# EasyEDA Pro project CSR8675_Module_Bluetooth_Speaker.eprj

# Schematic Schematic1
Create Date: 2024-04-20; Page Name: P1; Project Name: CSR8675_Module_Bluetooth_Speaker; Schematic Name: Schematic1; Update Date: 2024-04-27; Company: 嘉立创EDA; Page Size: A4; Version: V1.0
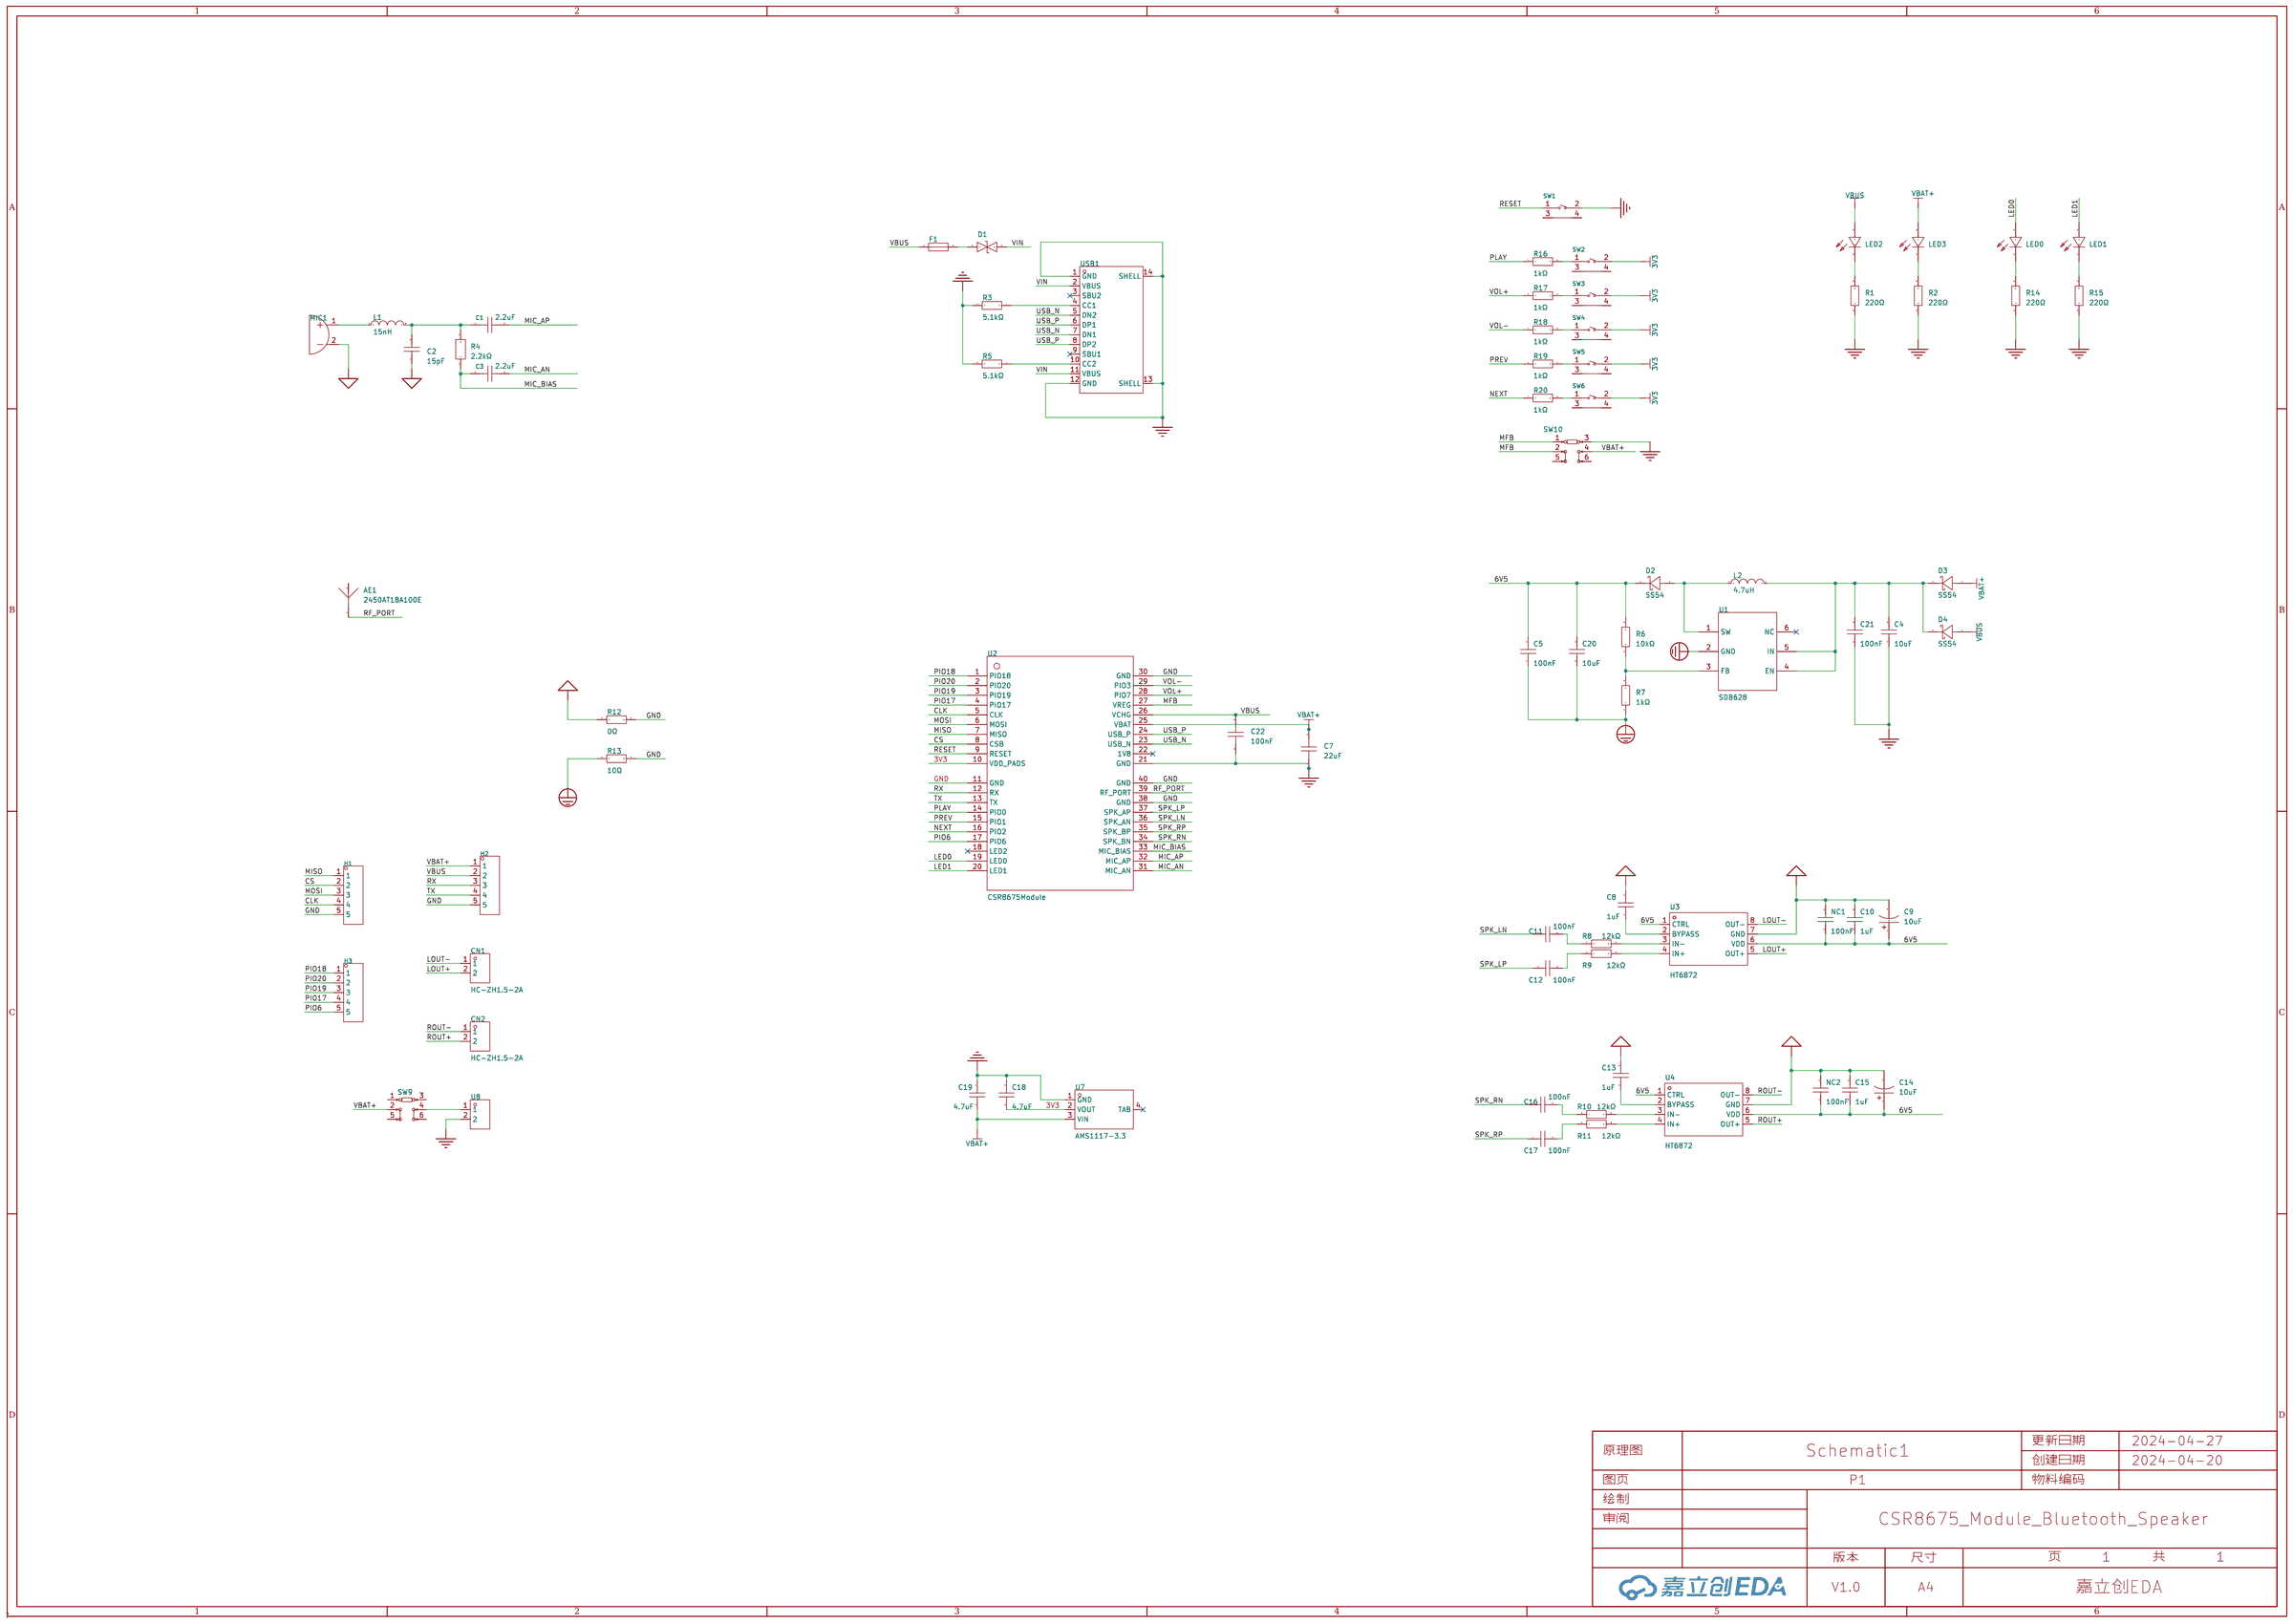
[diagram p0: schematic sheet]

## Parts
AE1  2450AT18A100E  [ANT-SMD_L3.2-W1.6]
C1  2.2uF  [C0603]
C2  15pF  [C0603]
C3  2.2uF  [C0603]
C4  10uF  [C0603]
C5  100nF  [C0603]
C7  22uF  [c0805]
C8  1uF  [C0603]
C9  10uF  [CAP-TH_BD5.0-P2.00-D0.8-FD]
C10  1uF  [C0603]
C11  100nF  [C0603]
C12  100nF  [C0603]
C13  1uF  [C0603]
C14  10uF  [CAP-TH_BD5.0-P2.00-D0.8-FD]
C15  1uF  [C0603]
C16  100nF  [C0603]
C17  100nF  [C0603]
C18  4.7uF  [c0805]
C19  4.7uF  [c0805]
C20  10uF  [C0603]
C21  100nF  [C0603]
C22  100nF  [C0603]
CN1  HC-ZH1.5-2A  [CONN-TH_2P-P1.50_HCTL_HC-ZH1.5-2A]
CN2  HC-ZH1.5-2A  [CONN-TH_2P-P1.50_HCTL_HC-ZH1.5-2A]
D1  0603ESDA-05N  [D0603-BI]
D2  SS54  [SMA_L4.3-W2.6-LS5.0-FD]
D3  SS54  [SMA_L4.3-W2.6-LS5.0-FD]
D4  SS54  [SMA_L4.3-W2.6-LS5.0-FD]
F1  BSMD1210L-500  [F1210]
H1  -  [HDR-TH_5P-P2.54-V-M]
H2  -  [HDR-TH_5P-P2.54-V-M]
H3  -  [HDR-TH_5P-P2.54-V-M]
L1  15nH  [L0805]
L2  4.7uH  [IND-SMD_L4.4-W4.2]
LED0  NCD0603R1  [LED0603-RD_RED]
LED1  NCD0603R1  [LED0603-RD_RED]
LED2  NCD0603R1  [LED0603-RD_RED]
LED3  NCD0603R1  [LED0603-RD_RED]
MIC1  GMI6027P-34DB  [MIC-TH_BD6.0-P1.90-D0.4-L]
NC1  100nF  [C0603]
NC2  100nF  [C0603]
R1  220Ω  [R0603]
R2  220Ω  [R0603]
R3  5.1kΩ  [R0603]
R4  2.2kΩ  [R0603]
R5  5.1kΩ  [R0603]
R6  10kΩ  [R0603]
R7  1kΩ  [R0603]
R8  12kΩ  [R0603]
R9  12kΩ  [R0603]
R10  12kΩ  [R0603]
R11  12kΩ  [R0603]
R12  0Ω  [R0603]
R13  10Ω  [R0603]
R14  220Ω  [R0603]
R15  220Ω  [R0603]
R16  1kΩ  [R0603]
R17  1kΩ  [R0603]
R18  1kΩ  [R0603]
R19  1kΩ  [R0603]
R20  1kΩ  [R0603]
SW1  TC-6615-5-260G  [SW-TH_4P-L7.5-W5.0-P4.50]
SW2  TC-6615-5-260G  [SW-TH_4P-L7.5-W5.0-P4.50]
SW3  TC-6615-5-260G  [SW-TH_4P-L7.5-W5.0-P4.50]
SW4  TC-6615-5-260G  [SW-TH_4P-L7.5-W5.0-P4.50]
SW5  TC-6615-5-260G  [SW-TH_4P-L7.5-W5.0-P4.50]
SW6  TC-6615-5-260G  [SW-TH_4P-L7.5-W5.0-P4.50]
SW9  XKB5858-Z-E  [SW-TH_XKB5858-Z-E]
SW10  XKB5858-Z-E  [SW-TH_XKB5858-Z-E]
U1  SDB628  [SOT-23-6_L2.9-W1.6-P0.95-LS2.8-BR]
U2  CSR8675Module  [CSR8675Module]
U3  HT6872  [SOP-8_L4.9-W3.9-P1.27-LS6.0-BL]
U4  HT6872  [SOP-8_L4.9-W3.9-P1.27-LS6.0-BL]
U7  AMS1117-3.3  [SOT-223-3_L6.5-W3.5-P3.05-LS7.0]
U8  WAFER-XH254Z-2A  [CONN-TH_2P-P2.50_XH-2A_3045048]
USB1  TYPE-C 16PIN 2MD(073)  [USB-C-SMD_TYPE-C-6PIN-2MD-073]

## Library data of the parts
AE1 = 2450AT18A100E: 天线类型:2.4G天线;中心频点:2.4GHz;带宽:-;峰值增益:0.5dBi;极化方式:-;功率容量:2W;驻波比:-;; LCSC Part Name: 2.4G天线; Supplier Part: C89334; Manufacturer: JOHANSON(约翰逊); Supplier Footprint: 1206; JLCPCB Part Class: 扩展库; Datasheet: https://atta.szlcsc.com/upload/public/pdf/source/20180301/C89334_15198946260391384223.pdf; Supplier: LCSC; Antenna Type: 2.4G天线; Central Frequency: 2.4GHz; Peak Gain: 0.5dBi; Impedance: 50Ω; Power capacity: 2W; Operating Temperature: -40℃~+125℃
C1 C3 = CL10A225KB8NNNC: 容值:2.2uF;精度:±10%;额定电压:50V;材质(温度系数):X5R;; LCSC Part Name: 2.2uF ±10% 50V; Supplier Part: C913904; Manufacturer: SAMSUNG(三星); Supplier Footprint: 0603; JLCPCB Part Class: 扩展库; Datasheet: https://atta.szlcsc.com/upload/public/pdf/source/20160218/1457707763339.pdf; Supplier: LCSC; Tolerance: ±10%; Voltage Rated: 50V; Temperature Coefficient: X5R
C2 = CC0603JRNPO9BN150: 容值:15pF;精度:±5%;额定电压:50V;材质(温度系数):NP0;; LCSC Part Name: 15pF ±5% 50V; Supplier Part: C107037; Manufacturer: YAGEO(国巨); Supplier Footprint: 0603; JLCPCB Part Class: 扩展库; Datasheet: https://atta.szlcsc.com/upload/public/pdf/source/20170914/C128857_1505359892143968080.pdf; Supplier: LCSC; Tolerance: ±5%; Voltage Rated: 50V; Temperature Coefficient: NP0
C4 C5 C8 C10 C13 C15 C20 C21 = CL10A105KB8NNNC: 容值:1uF;精度:±10%;额定电压:50V;材质(温度系数):X5R;; LCSC Part Name: 1uF ±10% 50V; Supplier Part: C15849; Manufacturer: SAMSUNG(三星); Supplier Footprint: 0603; JLCPCB Part Class: 基础库; Datasheet: https://atta.szlcsc.com/upload/public/pdf/source/20160218/1457707763339.pdf; Supplier: LCSC; Tolerance: ±10%; Voltage Rated: 50V; Temperature Coefficient: X5R
C7 = CL21A226MAQNNNE: 容值:22uF;精度:±20%;额定电压:25V;材质(温度系数):X5R;; LCSC Part Name: 22uF ±20% 25V; Supplier Part: C45783; Manufacturer: SAMSUNG(三星); Supplier Footprint: 0805; JLCPCB Part Class: 基础库; Datasheet: https://atta.szlcsc.com/upload/public/pdf/source/20160218/1457707763339.pdf; Supplier: LCSC; Tolerance: ±20%; Voltage Rated: 25V; Temperature Coefficient: X5R
C9 C14 = 01EC1809SHC10UF50V: 容值:10uF;精度:±20%;额定电压:50V;纹波电流:50mA@120Hz;等效串联电阻:-;; LCSC Part Name: 10uF ±20% 50V; Supplier Part: C503219; Manufacturer: KNSCHA(科尼盛); Supplier Footprint: 插件,D5xL11mm; JLCPCB Part Class: 扩展库; Datasheet: https://atta.szlcsc.com/upload/public/pdf/source/20200324/C503219_39D1683F20D4DB1C41D8BE9142629697.pdf; Supplier: LCSC; Tolerance: ±20%; Rated Voltage: 50V; Ripple Current: 50mA@120Hz; Lead Spacing: 2mm; φD: 5mm; L: 11mm; Lifetime @ Temp: 5000hrs@105℃
C11 C12 C16 C17 = 0603B104K500NT: 容值:100nF;精度:±10%;额定电压:50V;材质(温度系数):X7R;; LCSC Part Name: 100nF ±10% 50V; Supplier Part: C30926; Manufacturer: FH(风华); Supplier Footprint: 0603; JLCPCB Part Class: 扩展库; Datasheet: https://atta.szlcsc.com/upload/public/pdf/source/20200305/C486355_26A10D38EF8C2A5C37091D0039909270.pdf; Supplier: LCSC; Tolerance: ±10%; Voltage Rated: 50V; Temperature Coefficient: X7R
C18 C19 = CL21A475KAQNNNE: 容值:4.7uF;精度:±10%;额定电压:25V;材质(温度系数):X5R;; LCSC Part Name: 4.7uF ±10% 25V; Supplier Part: C1779; Manufacturer: SAMSUNG(三星); Supplier Footprint: 0805; JLCPCB Part Class: 基础库; Datasheet: https://atta.szlcsc.com/upload/public/pdf/source/20160218/1457707763339.pdf; Supplier: LCSC; Tolerance: ±10%; Voltage Rated: 25V; Temperature Coefficient: X5R
C22 = CC0603KRX7R9BB104: 容值:100nF;精度:±10%;额定电压:50V;材质(温度系数):X7R;; LCSC Part Name: 100nF ±10% 50V; Supplier Part: C14663; Manufacturer: YAGEO(国巨); Supplier Footprint: 0603; JLCPCB Part Class: 基础库; Datasheet: https://atta.szlcsc.com/upload/public/pdf/source/20180910/C282072_33301C7F631E79921B82A8DAC6BCC5B3.pdf; Supplier: LCSC; Tolerance: ±10%; Voltage Rated: 50V; Temperature Coefficient: X7R
CN1 CN2 = HC-ZH1.5-2A: 插针结构:1x2P;间距:1.5mm;安装方式:直插;参考系列:ZH;总PIN数:2P;排数:1;每排PIN数:2;行距:-;额定电流:1A;触头材质:黄铜;触头镀层:锡;工作温度范围:-25℃~+85℃;; LCSC Part Name: 1x2P 间距:1.5mm 直插 系列:ZH; Supplier Part: C2845550; Manufacturer: HCTL(华灿天禄); Supplier Footprint: 插件,P=1.5mm; JLCPCB Part Class: 扩展库; Datasheet: https://atta.szlcsc.com/upload/public/pdf/source/20230711/891FEA77A098E3B44CC72703EA57A8B8.pdf; Supplier: LCSC; Pins Structure: 1x2P; Pitch: 1.5mm; Mounting Style: 直插; Reference Series: ZH; Number of Pins: 2P; Number of Rows: 1; Number of PINs Per Row: 2; Current Rating (Max): 1A; Contact Material: 黄铜; Contact Plating: 锡; Operating Temperature Range: -25℃~+85℃
D1 = 0603ESDA-05N: 极性:双向;反向截止电压(Vrwm):5V;最大钳位电压:50V;; LCSC Part Name: 双向ESD; Supplier Part: C316054; Manufacturer: BORN(伯恩半导体); Supplier Footprint: 0603; JLCPCB Part Class: 扩展库; Datasheet: https://atta.szlcsc.com/upload/public/pdf/source/20200528/C316054_1CC523E9CE69E41C8DD5A05C832CCD1A.pdf; Supplier: LCSC; polarity: 双向; Reverse Stand-Off Voltage (Vrwm): 5V; Maximum Clamping Voltage: 50V; Type: ESD
D2-D4 = SS54_C7420369: 二极管配置:独立式;正向压降(Vf):550mV@5.0A;直流反向耐压(Vr):40V;平均整流电流(Io):5A;; LCSC Part Name: 电压:40V 电流:5A; Supplier Part: C7420369; Manufacturer: 宏迦橙; Supplier Footprint: SMA(DO-214AC); JLCPCB Part Class: 扩展库; Datasheet: https://atta.szlcsc.com/upload/public/pdf/source/20230828/254C3882F8647358AD9F60DD73611B5E.pdf; Supplier: LCSC; Diode Configuration: 独立式; Forward Voltage (Vf@If): 550mV@5.0A; Reverse Voltage (Vr): 40V; Average Rectified Current (Io): 5A; Reverse Leakage Current (Ir): 50uA@40V; Peak forward surge current: 120A
F1 = BSMD1210L-500: 最大电压:6V;最大电流:50A;保持电流:5A;跳闸电流:10A;; LCSC Part Name: 6V 5A 1210自恢复; Supplier Part: C976308; Manufacturer: BHFUSE(佰宏); Supplier Footprint: 1210; JLCPCB Part Class: 扩展库; Datasheet: https://atta.szlcsc.com/upload/public/pdf/source/20230512/9080FFF75F270CBB88A3FCF75D568934.pdf; Supplier: LCSC; Operating Voltage (Max): 6V; Current Rating (Max): 50A; Hold Current: 5A; Trip Current: 10A; Power Dissipation: 1.5W; Resistance - Initial (Ri) (Min): 1mΩ; Resistance - Post Trip (R1) (Max): 12mΩ; Maximum Time to Trip: 5s; Operating Temperature: -40℃~+85℃
H1-H3 = HDR-M_2.54_1x5P: Supplier Part: C358687; Supplier Footprint: 插件
L1 = VHF201209H15NJT: 电感值:15nH;精度:±5%;额定电流:300mA;饱和电流(Isat):-;直流电阻(DCR):400mΩ;; LCSC Part Name: 15nH ±5%; Supplier Part: C139275; Manufacturer: FH(风华); Supplier Footprint: 0805; JLCPCB Part Class: 扩展库; Datasheet: https://atta.szlcsc.com/upload/public/pdf/source/20230223/DB206AC541C71FBD79E291598E86C2F5.pdf; Supplier: LCSC; Tolerance: ±5%; Rated Current: 300mA; DC Resistance (DCR): 400mΩ
L2 = FXL0420-4R7-M: 电感值:4.7uH;精度:±20%;额定电流:2.8A;饱和电流(Isat):3A;类型:一体成型电感;; LCSC Part Name: 4.7uH ±20% 3A; Supplier Part: C167208; Manufacturer: cjiang(长江微电); Supplier Footprint: SMD,4.2x4.4mm; JLCPCB Part Class: 扩展库; Datasheet: https://atta.szlcsc.com/upload/public/pdf/source/20230516/FBADA9890E7FBE97C620F1D8B562D733.pdf; Supplier: LCSC; Tolerance: ±20%; Rated Current: 2.8A; Saturation Current (Isat): 3A; DC Resistance (DCR): 105mΩ; Type: 一体成型电感
LED0-LED3 = NCD0603R1_C84263: 灯头类型:-;发光颜色:红色;正向电压(VF):1.6V~2.6V;功率:65mW;正向电流:20mA;主波长:615nm~630nm;二极管配置:独立二极管;透镜颜色:无色透明透镜;色温:-;发光强度:80mcd~220mcd;发光角度:130°;载带方式:-;工作温度:-30℃~+85℃;; Supplier Part: C84263; Manufacturer: 国星光电; Supplier Footprint: 0603; JLCPCB Part Class: 扩展库; Datasheet: https://atta.szlcsc.com/upload/public/pdf/source/20200820/C84263_DABC6A75E58F576973B407FDBA283D60.pdf; Supplier: LCSC; Emitted Color: 红色; Forward Voltage (VF): 1.6V~2.6V; Power Dissipation: 65mW; Forward Current: 20mA; Dominant Wavelength: 615nm~630nm; Diode Configuration: 独立二极管; Lens Color: 无色透明透镜; Luminous Intensity: 80mcd~220mcd; Viewing Angle: 130°; Operating Temperature: -30℃~+85℃
MIC1 = GMI6027P-34DB: Supplier Part: C529954; Manufacturer: INGHAi(赢海); JLCPCB Part Class: 扩展库; Datasheet: https://atta.szlcsc.com/upload/public/pdf/source/20200702/C529952_807F7012EAC801A742D0A79789145B73.pdf; Supplier: LCSC
NC1 NC2 = CC0603KRX7R9BB103: 容值:10nF;精度:±10%;额定电压:50V;材质(温度系数):X7R;; LCSC Part Name: 10nF ±10% 50V; Supplier Part: C100042; Manufacturer: YAGEO(国巨); Supplier Footprint: 0603; JLCPCB Part Class: 扩展库; Datasheet: https://atta.szlcsc.com/upload/public/pdf/source/20181008/C309510_22F155564471FAF6A489F7D68F34234E.pdf; Supplier: LCSC; Tolerance: ±10%; Voltage Rated: 50V; Temperature Coefficient: X7R
R1 R2 R14 R15 = 0603WAJ0221T5E: 电阻类型:厚膜电阻;阻值:220Ω;精度:±5%;功率:100mW;最大工作电压:75V;温度系数:±100ppm/℃;; LCSC Part Name: 220Ω ±5% 100mW 厚膜电阻; Supplier Part: C1226; Manufacturer: UNI-ROYAL(厚声); Supplier Footprint: 0603; JLCPCB Part Class: 扩展库; Datasheet: https://atta.szlcsc.com/upload/public/pdf/source/20200306/C422600_1E6D84923E4A46A82E41ADD87F860B5C.pdf; Supplier: LCSC; Type: 厚膜电阻; Tolerance: ±5%; Power(Watts): 100mW; Overload Voltage (Max): 75V; Temperature Coefficient: ±100ppm/℃; Operating Temperature Range: -55℃~+155℃
R3 R5 = 0603WAF5101T5E: 电阻类型:厚膜电阻;阻值:5.1kΩ;精度:±1%;功率:100mW;最大工作电压:75V;温度系数:±100ppm/℃;; LCSC Part Name: 5.1kΩ ±1% 100mW 厚膜电阻; Supplier Part: C23186; Manufacturer: UNI-ROYAL(厚声); Supplier Footprint: 0603; JLCPCB Part Class: 基础库; Datasheet: https://atta.szlcsc.com/upload/public/pdf/source/20200306/C422600_1E6D84923E4A46A82E41ADD87F860B5C.pdf; Supplier: LCSC; Type: 厚膜电阻; Tolerance: ±1%; Power(Watts): 100mW; Overload Voltage (Max): 75V; Temperature Coefficient: ±100ppm/℃; Operating Temperature Range: -55℃~+155℃
R4 = FRC0603J222 TS: 电阻类型:厚膜电阻;阻值:2.2kΩ;精度:±5%;功率:100mW;最大工作电压:75V;温度系数:±100ppm/℃;; LCSC Part Name: 2.2kΩ ±5% 100mW 厚膜电阻; Supplier Part: C2907117; Manufacturer: FOJAN(富捷); Supplier Footprint: 0603; JLCPCB Part Class: 扩展库; Datasheet: https://atta.szlcsc.com/upload/public/pdf/source/20211221/925EC7D7225764EE0046F22065062C87.pdf; Supplier: LCSC; Type: 厚膜电阻; Tolerance: ±5%; Power(Watts): 100mW; Overload Voltage (Max): 75V; Temperature Coefficient: ±100ppm/℃; Operating Temperature Range: -55℃~+155℃
R6 = 0603WAF1002T5E: 电阻类型:厚膜电阻;阻值:10kΩ;精度:±1%;功率:100mW;最大工作电压:75V;温度系数:±100ppm/℃;; LCSC Part Name: 厚膜电阻 10kΩ ±1% 100mW; Supplier Part: C25804; Manufacturer: UNI-ROYAL(厚声); Supplier Footprint: 0603; JLCPCB Part Class: 基础库; Datasheet: https://atta.szlcsc.com/upload/public/pdf/source/20200306/C422600_1E6D84923E4A46A82E41ADD87F860B5C.pdf; Supplier: LCSC; Type: 厚膜电阻; Tolerance: ±1%; Power(Watts): 100mW; Overload Voltage (Max): 75V; Temperature Coefficient: ±100ppm/℃; Operating Temperature Range: -55℃~+155℃
R7 R16-R20 = RC0603FR-071KL: 电阻类型:厚膜电阻;阻值:1kΩ;精度:±1%;功率:100mW;最大工作电压:75V;温度系数:±100ppm/℃;; LCSC Part Name: 厚膜电阻 1kΩ ±1% 100mW; Supplier Part: C22548; Manufacturer: YAGEO(国巨); Supplier Footprint: 0603; JLCPCB Part Class: 扩展库; Datasheet: https://atta.szlcsc.com/upload/public/pdf/source/20180316/70C0E2BDAE7FCC62C531A5A58D202EE1.pdf; Supplier: LCSC; Type: 厚膜电阻; Tolerance: ±1%; Power(Watts): 100mW; Overload Voltage (Max): 75V; Temperature Coefficient: ±100ppm/℃; Operating Temperature Range: -55℃~+155℃
R8-R11 = 0603WAF1202T5E: 电阻类型:厚膜电阻;阻值:12kΩ;精度:±1%;功率:100mW;最大工作电压:75V;温度系数:±100ppm/℃;; LCSC Part Name: 12kΩ ±1% 100mW 厚膜电阻; Supplier Part: C22790; Manufacturer: UNI-ROYAL(厚声); Supplier Footprint: 0603; JLCPCB Part Class: 基础库; Datasheet: https://atta.szlcsc.com/upload/public/pdf/source/20200306/C422600_1E6D84923E4A46A82E41ADD87F860B5C.pdf; Supplier: LCSC; Type: 厚膜电阻; Tolerance: ±1%; Power(Watts): 100mW; Overload Voltage (Max): 75V; Temperature Coefficient: ±100ppm/℃; Operating Temperature Range: -55℃~+155℃
R12 R13 = 0603WAF0000T5E: 电阻类型:厚膜电阻;阻值:0Ω;精度:±1%;功率:100mW;最大工作电压:75V;; LCSC Part Name: 0Ω ±1% 100mW 厚膜电阻; Supplier Part: C21189; Manufacturer: UNI-ROYAL(厚声); Supplier Footprint: 0603; JLCPCB Part Class: 基础库; Datasheet: https://atta.szlcsc.com/upload/public/pdf/source/20200306/C422600_1E6D84923E4A46A82E41ADD87F860B5C.pdf; Supplier: LCSC; Type: 厚膜电阻; Tolerance: ±1%; Power(Watts): 100mW; Overload Voltage (Max): 75V; Operating Temperature Range: -55℃~+155℃
SW1-SW6 = TC-6615-5-260G: 电路结构:单刀单掷;按钮形状:-;作用力:260gf;安装方式:卧插;开关长度:6mm;开关宽度:6mm;开关高度:5mm;带支架:带支架;触点电流:50mA;额定电压(AC):-;额定电压(DC):12V;额定功率:-;绝缘电阻:-;带灯:-;机械寿命:-;; LCSC Part Name: 轻触6*6*5支架 插件260g; Supplier Part: C2845270; Manufacturer: HCTL(华灿天禄); Supplier Footprint: 插件; JLCPCB Part Class: 扩展库; Datasheet: https://atta.szlcsc.com/upload/public/pdf/source/20230523/3B07ECEFF69432C539FEAF1B55455C52.pdf; Supplier: LCSC; Circuit: 单刀单掷; Operating Force: 260gf; Mounting Style: 卧插; Switch Length: 6mm; Switch Width: 6mm; Switch Height: 5mm; Strike Gundam: 带支架; Contact Current: 50mA; Voltage Rating (DC): 12V
SW9 SW10 = XKB5858-Z-E: 自锁/无锁:自锁;安装方式:卧插;触点电流:100mA;额定电压 (AC):250V;额定电压 (DC):30V;带灯:不带;作用力:250gf;机械寿命:10万次;; Supplier Part: C780038; Manufacturer: XKB Connectivity(中国星坤); Supplier Footprint: 插件; JLCPCB Part Class: 扩展库; Datasheet: https://atta.szlcsc.com/upload/public/pdf/source/20211011/56D3FA9FC185EAC41365C3B37B684CC1.pdf; Supplier: LCSC; Self Lock / No Lock: 自锁; Actuator Style: 方形按钮; Mounting Style: 卧插; Contact Current: 100mA; Voltage Rating (AC): 250V; Voltage Rating (DC): 30V; Insulation Resistance: 100MΩ; Actuator/Cap Color: 白色; With Lamp: 不带; Pin Style: PC引脚; Operating Force: 250gf; Operating Temperature: -15℃~+55℃; Mechanical Life: 10万次
U1 = SDB628: 功能类型:升压型;输入电压:2V~24V;输出电压:28V;输出电流(最大值):2A;; Supplier Part: C77805; Manufacturer: SHOUDING(首鼎半导体); Supplier Footprint: SOT-23-6; JLCPCB Part Class: 扩展库; Datasheet: https://atta.szlcsc.com/upload/public/pdf/source/20160823/1471947522087.pdf; Supplier: LCSC; Function: 升压型; Input Voltage: 2V~24V; Output Voltage: 28V; Output Current (Max): 2A; Switching Frequency: 1.2MHz; Synchronous Rectification: 否; Number of Outputs: 1; Topology: 升压式; Switch tube (built-in/external): 内置
U2 = CSR8675module: 蓝牙库
U3 U4 = HT6872: 功放类型:D类功放;扬声器通道数:单声道;输出功率:3.85Wx1@4Ω;; LCSC Part Name: 3.85W单声道D类音频功率放大器; Supplier Part: C93112; Manufacturer: 嘉兴禾润; Supplier Footprint: SOP-8; JLCPCB Part Class: 扩展库; Datasheet: https://atta.szlcsc.com/upload/public/pdf/source/20170925/C93112_1506321759294990568.pdf; Supplier: LCSC; Type of Power Amplifier: D类功放; Speaker Channels: 单声道; Output Power: 3.85Wx1@4Ω; Supply Voltage: 2.5V~6.5V
U7 = AMS1117-3.3_C5250992: 输出类型：固定 输出极性：正 最大输入电压：18V 输出电压：3.3V 输出电流：1A 电源纹波抑制比(PSRR)：60dB@(120Hz)。当前应用较多领域：三端稳压器，机顶盒; Supplier Part: C5250992; Manufacturer: TWGMC(台湾迪嘉); Supplier Footprint: SOT-223-3L; JLCPCB Part Class: 扩展库; Datasheet: https://atta.szlcsc.com/upload/public/pdf/source/20221109/A58A92B07670E85D28928AE371260E8D.pdf; Supplier: LCSC
U8 = WAFER-XH254Z-2A: 插针结构:1x2P;间距:2.54mm;安装方式:直插;参考系列:XH;总PIN数:2P;排数:1;每排PIN数:2;额定电流:3A;工作温度范围:-25℃~+85℃;; Supplier Part: C7432682; Manufacturer: HANBO(汉博); Supplier Footprint: 插件,P=2.5mm; JLCPCB Part Class: Extended Part; Datasheet: https://atta.szlcsc.com/upload/public/pdf/source/20230718/3B4FABA5D38EFB02DAF74E7C2B33D98F.pdf; Supplier: LCSC; Pins Structure: 1x2P; Pitch: 2.54mm; Mounting Style: 直插; Reference Series: XH; Number of Pins: 2P; Number of Rows: 1; Number of PINs Per Row: 2; Current Rating (Max): 3A; Operating Temperature Range: -25℃~+85℃
USB1 = TYPE-C 16PIN 2MD(073): 连接器类型:Type-C;标准:-;公母:母;端口数量:1;触点数量:16P;安装方式:卧贴;额定电流 - 电源:5A;工作温度范围:-25℃~+85℃;; LCSC Part Name: Type-C 母 卧贴; Supplier Part: C2765186; Manufacturer: SHOU HAN(首韩); Supplier Footprint: SMD; JLCPCB Part Class: 扩展库; Datasheet: https://atta.szlcsc.com/upload/public/pdf/source/20211123/39B17C16241EAC15C5E277BDA434118E.pdf; Supplier: LCSC; Connector Type: Type-C; Gender: 母; Number of Ports: 1; Number of Contacts: 16P; Mounting Style: 卧贴; Current Rating - Power (Max): 5A; Operating Temperature Range: -25℃~+85℃

## Nets
3V3: C18.2 SW2.2 SW3.2 SW4.2 SW5.2 SW6.2 U2.10(VDD_PADS) U7.2(VOUT)
6V5: C5.2 C9.1 C10.1 C14.1 C15.1 C20.2 D2.2(K) NC1.1 NC2.1 R6.2 U3.1(CTRL) U3.6(VDD) U4.1(CTRL) U4.6(VDD)
AGND: C2.1 C8.2 C9.2 C10.2 C13.2 C14.2 C15.2 MIC1.2 NC1.2 NC2.2 R12.1 U3.7(GND) U4.7(GND)
GND: C4.1 C7.1 C18.1 C19.1 C21.1 C22.1 H1.5 H2.5 R1.1 R2.1 R3.2 R5.2 R12.2 R13.2 R14.1 R15.1 SW1.2 SW10.3 U2.11(GND) U2.21(GND) U2.30(GND) U2.38(GND) U2.40(GND) U7.1(GND) U8.2 USB1.1(GND) USB1.12(GND) USB1.13(SHELL) USB1.14(SHELL)
PGND: C5.1 C20.1 R7.1 R13.1 U1.2(GND)
VBAT+: C7.2 C19.2 D3.1(A) H2.1 LED3.2(A) SW9.2 SW10.4 U2.25(VBAT) U7.3(VIN)
VBUS: C22.2 D4.1(A) F1.1 H2.2 LED2.2(A) U2.26(VCHG)
VIN: D1.2 USB1.2(VBUS) USB1.11(VBUS)
CLK: H1.4 U2.5(CLK)
CS: H1.2 U2.8(CSB)
LED0: LED0.2(A) U2.19(LED0)
LED1: LED1.2(A) U2.20(LED1)
LOUT+: CN1.2 U3.5(OUT+)
LOUT-: CN1.1 U3.8(OUT-)
MFB: SW10.1 SW10.2 U2.27(VREG)
MIC_AN: C3.2 U2.31(MIC_AN)
MIC_AP: C1.2 U2.32(MIC_AP)
MIC_BIAS: C3.1 R4.1 U2.33(MIC_BIAS)
MISO: H1.1 U2.7(MISO)
MOSI: H1.3 U2.6(MOSI)
NEXT: R20.1 U2.16(PIO2)
PIO6: H3.5 U2.17(PIO6)
PIO17: H3.4 U2.4(PIO17)
PIO18: H3.1 U2.1(PIO18)
PIO19: H3.3 U2.3(PIO19)
PIO20: H3.2 U2.2(PIO20)
PLAY: R16.1 U2.14(PIO0)
PREV: R19.1 U2.15(PIO1)
RESET: SW1.1 U2.9(RESET)
RF_PORT: AE1.1(ANT) U2.39(RF_PORT)
ROUT+: CN2.2 U4.5(OUT+)
ROUT-: CN2.1 U4.8(OUT-)
RX: H2.3 U2.12(RX)
SPK_LN: C11.1 U2.36(SPK_AN)
SPK_LP: C12.1 U2.37(SPK_AP)
SPK_RN: C16.1 U2.34(SPK_BN)
SPK_RP: C17.1 U2.35(SPK_BP)
TX: H2.4 U2.13(TX)
USB_N: U2.23(USB_N) USB1.5(DN2) USB1.7(DN1)
USB_P: U2.24(USB_P) USB1.6(DP1) USB1.8(DP2)
VOL+: R17.1 U2.28(PIO7)
VOL-: R18.1 U2.29(PIO3)
$1N572: C1.1 C2.2 L1.2 R4.2
$1N573: L1.1 MIC1.1
$1N825: R3.1 USB1.4(CC1)
$1N826: R5.1 USB1.10(CC2)
$1N842: D1.1 F1.2
$1N1214: R16.2 SW2.1
$1N1216: R17.2 SW3.1
$1N1223: R18.2 SW4.1
$1N1225: R19.2 SW5.1
$1N1227: R20.2 SW6.1
$1N2026: D2.1(A) L2.1 U1.1(SW)
$1N2027: R6.1 R7.2 U1.3(FB)
$1N2036: R8.2 U3.3(IN-)
$1N2037: R9.2 U3.4(IN+)
$1N2038: C11.2 R8.1
$1N2039: C12.2 R9.1
$1N2041: C8.1 U3.2(BYPASS)
$1N2427: R10.2 U4.3(IN-)
$1N2428: R11.2 U4.4(IN+)
$1N2429: C16.2 R10.1
$1N2430: C17.2 R11.1
$1N2432: C13.1 U4.2(BYPASS)
$1N7630: LED2.1(K) R1.2
$1N7631: LED3.1(K) R2.2
$1N10372: SW9.4 U8.1
$1N20314: C4.2 C21.2 D3.2(K) D4.2(K) L2.2 U1.4(EN) U1.5(IN)
$1N24423: LED0.1(K) R14.2
$1N24424: LED1.1(K) R15.2

Not connected (* = marked no-connect by the designer): AE1 2; SW1 3 4; SW2 3 4; SW3 3 4; SW4 3 4; SW5 3 4; SW6 3 4; SW9 1 3 5 6; SW10 5 6; U1 6(NC)*; U2 18(LED2)* 22(1V8)*; U7 4(TAB)*; USB1 3(SBU2)* 9(SBU1)*

# Board PCB1
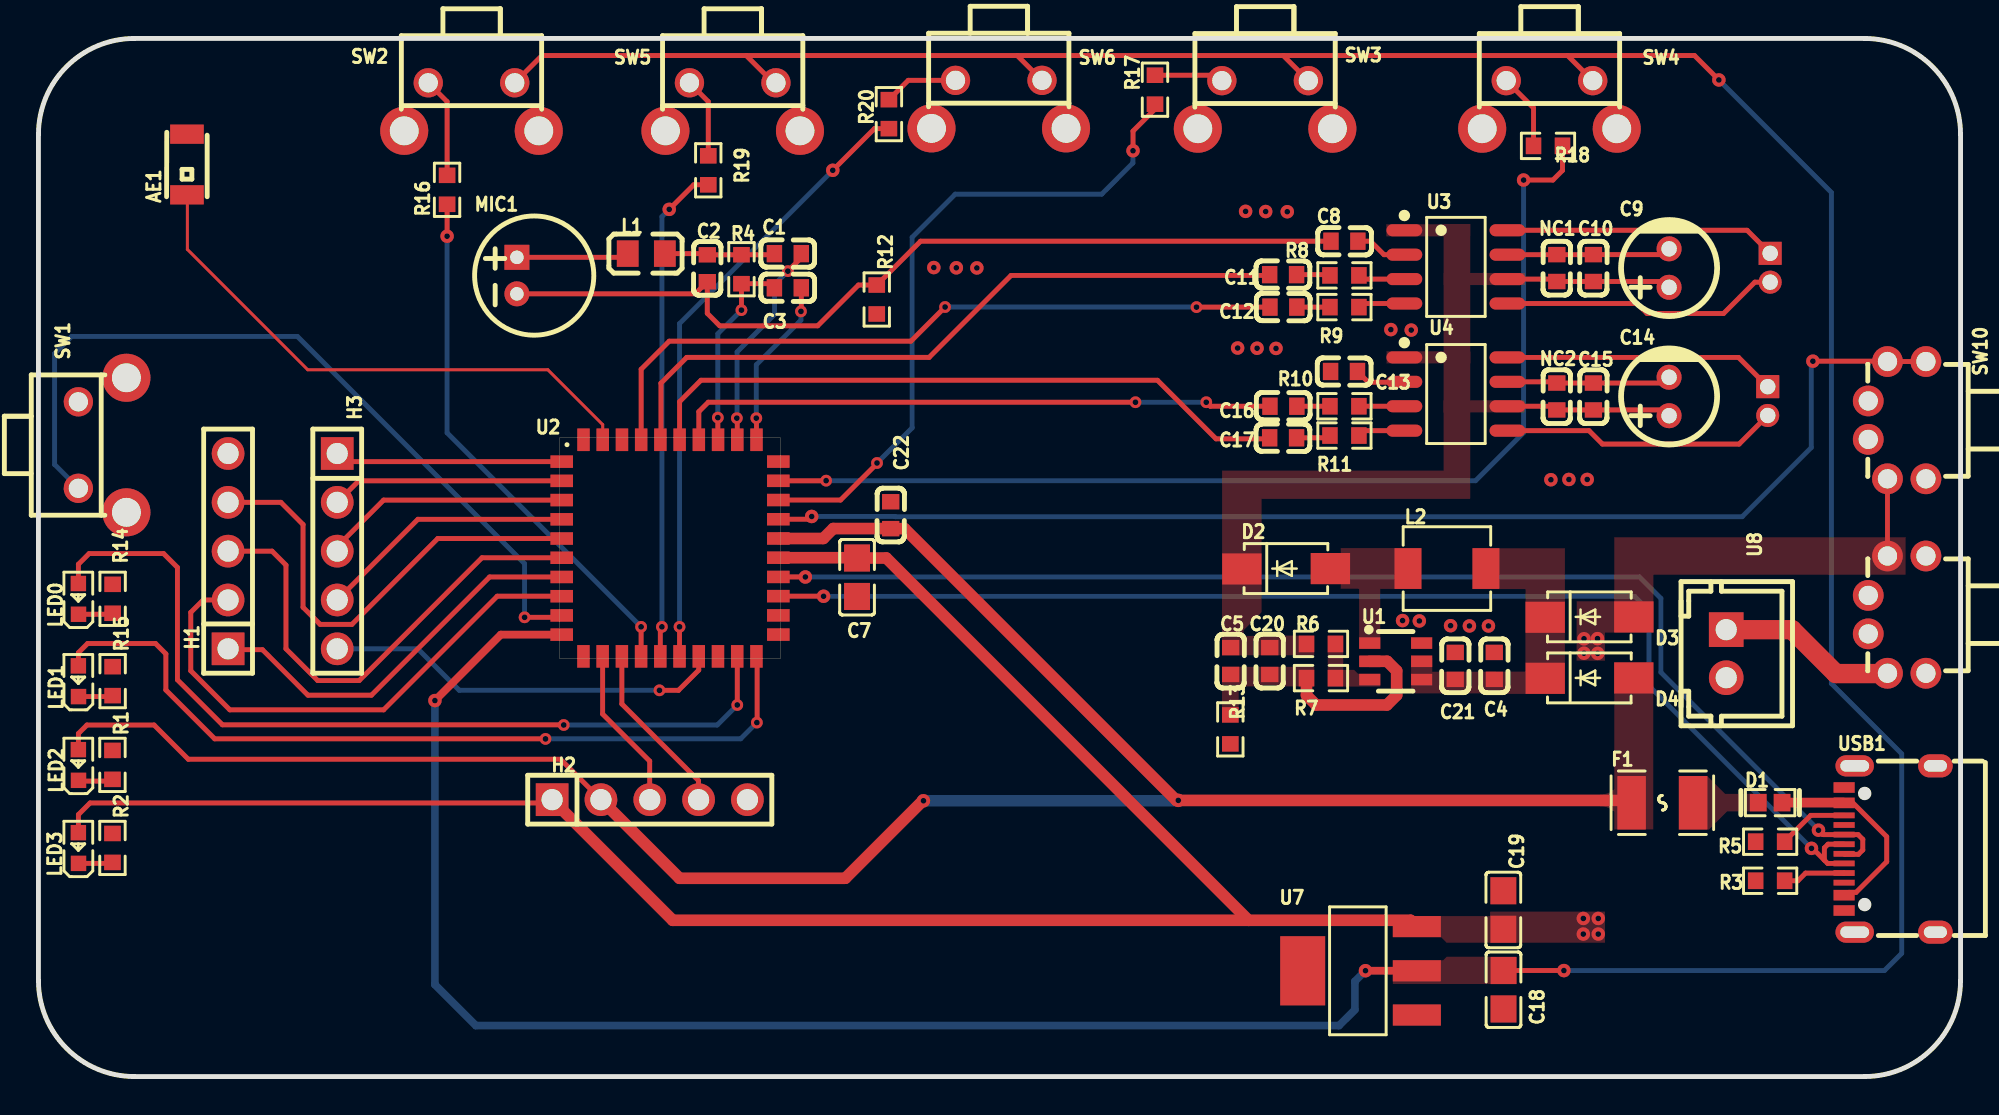
[diagram p1: board, top side]
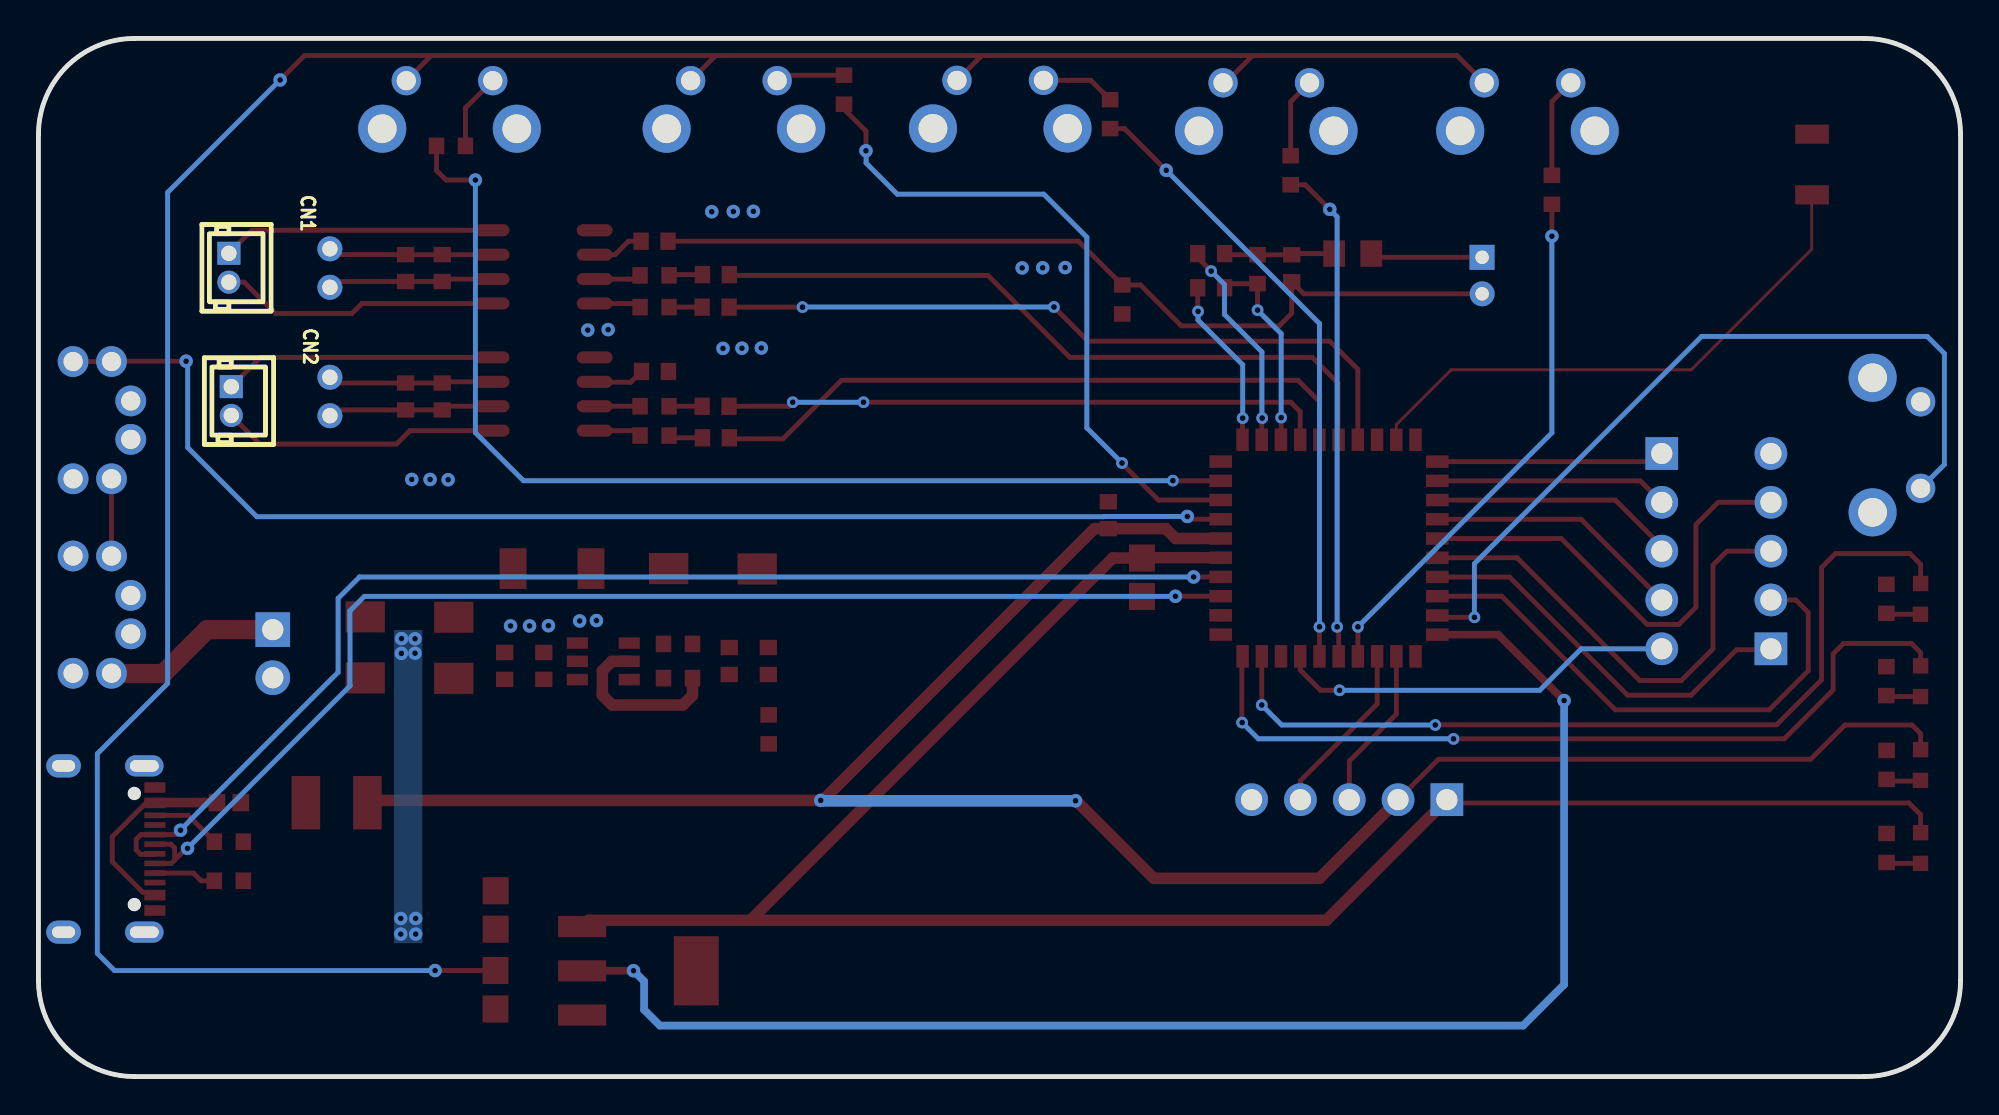
[diagram p2: board, bottom side, seen from below]

Outline 100 x 54 mm; copper layers: Top Layer, Bottom Layer. Coordinates in mm from the lower left corner of the outline.
Outline path: 0,49 0,5 arc(1.46,1.46) 5,0 95,0 arc(98.54,1.46) 100,5 100,49 arc(98.54,52.54) 95,54 5,54 arc(1.46,52.54) 0,49
Stack: Top Layer 0.035mm / Dielectric1 1.51mm FR4 er 4.5 / Bottom Layer 0.035mm

## Design rules (mm)
template: JLCPCB Capability(Two Layers Board)
spacing copperThickness1oz (default): track to track 0.102, other pairs 0.152 to 0.3
spacing copperThickness2oz: track to track 0.203, other pairs 0.152 to 0.3
track width copperThickness1oz (default): min 0.127, default 0.254, max 2.54
track width copperThickness2oz: min 0.203, default 0.254, max 2.54
differential pair differentialPair (default): width min 0.127, default 0.254, max 2.54; gap min 0.152, default 0.152
via viaSize (default): diameter min 0.5, default 0.61, max 10; hole min 0.3, default 0.305, max 6.3

## Placement (name value [footprint] x y rotation side)
AE1  2450AT18A100E  [ANT-SMD_L3.2-W1.6]  7.73 47.44 90 top
C1  2.2uF  [C0603]  38.99 42.81 0 top
C2  15pF  [C0603]  34.8 42.05 90 top
C3  2.2uF  [C0603]  38.99 41.03 0 top
C4  10uF  [C0603]  75.74 21.36 270 top
C5  100nF  [C0603]  62.03 21.61 90 top
C7  22uF  [c0805]  42.59 25.97 90 top
C8  1uF  [C0603]  67.95 43.45 180 top
C9  10uF  [CAP-TH_BD5.0-P2.00-D0.8-FD]  84.84 42.06 90 top
C10  1uF  [C0603]  80.9 42.06 90 top
C11  100nF  [C0603]  64.76 41.71 0 top
C12  100nF  [C0603]  64.77 40.02 0 top
C13  1uF  [C0603]  67.92 36.68 180 top
C14  10uF  [CAP-TH_BD5.0-P2.00-D0.8-FD]  84.84 35.38 90 top
C15  1uF  [C0603]  80.9 35.38 90 top
C16  100nF  [C0603]  64.77 34.87 0 top
C17  100nF  [C0603]  64.76 33.23 0 top
C18  4.7uF  [c0805]  76.22 4.52 90 top
C19  4.7uF  [c0805]  76.21 8.66 270 top
C20  10uF  [C0603]  64.06 21.61 90 top
C21  100nF  [C0603]  73.71 21.36 270 top
C22  100nF  [C0603]  44.34 29.2 270 top
CN1  HC-ZH1.5-2A  [CONN-TH_2P-P1.50_HCTL_HC-ZH1.5-2A]  90.09 42.07 270 bottom
CN2  HC-ZH1.5-2A  [CONN-TH_2P-P1.50_HCTL_HC-ZH1.5-2A]  89.97 35.14 270 bottom
D1  0603ESDA-05N  [D0603-BI]  90.09 14.25 0 top
D2  SS54  [SMA_L4.3-W2.6-LS5.0-FD]  64.91 26.41 180 top
D3  SS54  [SMA_L4.3-W2.6-LS5.0-FD]  80.7 23.9 180 top
D4  SS54  [SMA_L4.3-W2.6-LS5.0-FD]  80.7 20.73 180 top
F1  BSMD1210L-500  [F1210]  84.49 14.24 0 top
H1  -  [HDR-TH_5P-P2.54-V-M]  9.87 27.33 90 top
H2  -  [HDR-TH_5P-P2.54-V-M]  31.8 14.4 0 top
H3  -  [HDR-TH_5P-P2.54-V-M]  15.55 27.33 270 top
L1  15nH  [L0805]  31.62 42.81 0 top
L2  4.7uH  [IND-SMD_L4.4-W4.2]  73.28 26.42 180 top
LED0  NCD0603R1  [LED0603-RD_RED]  2.08 24.85 90 top
LED1  NCD0603R1  [LED0603-RD_RED]  2.08 20.56 90 top
LED2  NCD0603R1  [LED0603-RD_RED]  2.08 16.21 90 top
LED3  NCD0603R1  [LED0603-RD_RED]  2.08 11.89 90 top
MIC1  GMI6027P-34DB  [MIC-TH_BD6.0-P1.90-D0.4-L]  24.89 41.66 270 top
NC1  100nF  [C0603]  78.99 42.06 90 top
NC2  100nF  [C0603]  78.99 35.38 90 top
R1  220Ω  [R0603]  3.85 16.21 270 top
R2  220Ω  [R0603]  3.85 11.89 270 top
R3  5.1kΩ  [R0603]  90.09 10.18 180 top
R4  2.2kΩ  [R0603]  36.58 42 90 top
R5  5.1kΩ  [R0603]  90.09 12.22 180 top
R6  10kΩ  [R0603]  66.73 22.5 180 top
R7  1kΩ  [R0603]  66.73 20.73 0 top
R8  12kΩ  [R0603]  67.95 41.67 0 top
R9  12kΩ  [R0603]  67.95 40.02 0 top
R10  12kΩ  [R0603]  67.95 34.87 0 top
R11  12kΩ  [R0603]  67.95 33.34 0 top
R12  0Ω  [R0603]  43.61 40.42 270 top
R13  10Ω  [R0603]  62.01 18.06 270 top
R14  220Ω  [R0603]  3.86 24.85 270 top
R15  220Ω  [R0603]  3.86 20.57 270 top
R16  1kΩ  [R0603]  21.26 46.13 90 top
R17  1kΩ  [R0603]  58.09 51.33 90 top
R18  1kΩ  [R0603]  78.54 48.41 180 top
R19  1kΩ  [R0603]  34.85 47.14 90 top
R20  1kΩ  [R0603]  44.25 50.06 90 top
SW1  TC-6615-5-260G  [SW-TH_4P-L7.5-W5.0-P4.50]  3.33 32.85 90 top
SW2  TC-6615-5-260G  [SW-TH_4P-L7.5-W5.0-P4.50]  22.53 50.44 0 top
SW3  TC-6615-5-260G  [SW-TH_4P-L7.5-W5.0-P4.50]  63.82 50.55 0 top
SW4  TC-6615-5-260G  [SW-TH_4P-L7.5-W5.0-P4.50]  78.61 50.55 0 top
SW5  TC-6615-5-260G  [SW-TH_4P-L7.5-W5.0-P4.50]  36.12 50.44 0 top
SW6  TC-6615-5-260G  [SW-TH_4P-L7.5-W5.0-P4.50]  49.96 50.57 0 top
SW9  XKB5858-Z-E  [SW-TH_XKB5858-Z-E]  96.7 24.03 270 top
SW10  XKB5858-Z-E  [SW-TH_XKB5858-Z-E]  96.7 34.14 270 top
U1  SDB628  [SOT-23-6_L2.9-W1.6-P0.95-LS2.8-BR]  70.61 21.6 180 top
U2  -  [CSR8675Module]  27.1 21.74 0 top
U3  HT6872  [SOP-8_L4.9-W3.9-P1.27-LS6.0-BL]  73.75 42.12 270 top
U4  HT6872  [SOP-8_L4.9-W3.9-P1.27-LS6.0-BL]  73.75 35.5 270 top
U7  AMS1117-3.3  [SOT-223-3_L6.5-W3.5-P3.05-LS7.0]  68.74 5.5 0 top
U8  WAFER-XH254Z-2A  [CONN-TH_2P-P2.50_XH-2A_3045048]  87.81 22 270 top
USB1  TYPE-C 16PIN 2MD(073)  [USB-C-SMD_TYPE-C-6PIN-2MD-073]  96.32 11.84 90 top

## Footprints (pads in the part's own frame, mm; a bottom-side part is the same pattern mirrored in y, then rotated)
ANT-SMD_L3.2-W1.6
  rect 1x1.75 smd: 1(-1.578,0) 2(1.578,0)
C0603
  rect 0.8x0.9 smd: 1(-0.7,0) 2(0.7,0)
c0805
  rect 1.41x1.35 smd: 1(-1,0) 2(1,0)
CAP-TH_BD5.0-P2.00-D0.8-FD
  round 1.3 hole 0.8: 1(-1,0) 2(1,0)
CONN-TH_2P-P1.50_HCTL_HC-ZH1.5-2A
  rect 1.2x1.2 hole 0.8: 1(-0.75,0)
  round 1.2 hole 0.8: 2(0.75,0)
CONN-TH_2P-P2.50_XH-2A_3045048
  rect 1.8x1.8 hole 1.1: 1(-1.25,0)
  round 1.8 hole 1.1: 2(1.25,0)
CSR8675Module
  custom 1.175x0.65 smd: 1(0.121,10.245) 2(0.121,9.245) 3(0.121,8.245) 4(0.121,7.245) 5(0.121,6.245) 6(0.121,5.245) 7(0.121,4.245) 8(0.121,3.245) 9(0.121,2.245) 10(0.121,1.245) 21(11.391,1.248) 22(11.391,2.248) 23(11.391,3.248) 24(11.391,4.247) 25(11.391,5.247) 26(11.391,6.247) 27(11.391,7.247) 28(11.391,8.248) 29(11.391,9.248) 30(11.391,10.248)
  custom 0.65x1.175 smd: 11(1.252,0.116) 12(2.252,0.116) 13(3.252,0.116) 14(4.252,0.116) 15(5.252,0.116) 16(6.252,0.116) 17(7.252,0.116) 18(8.252,0.116) 19(9.252,0.116) 20(10.252,0.116) 31(10.255,11.382) 32(9.255,11.382) 33(8.255,11.382) 34(7.255,11.382) 35(6.255,11.382) 36(5.255,11.382) 37(4.255,11.382) 38(3.256,11.382) 39(2.256,11.382) 40(1.256,11.382)
D0603-BI
  rect 0.873x0.907 smd: 1(-0.622,0) 2(0.622,0)
F1210
  rect 1.485x2.781 smd: 1(-1.6,0) 2(1.6,0)
HDR-TH_5P-P2.54-V-M
  rect 1.7x1.7 hole 1.1: 1(-5.08,0)
  round 1.7 hole 1.1: 2(-2.54,0) 3(0,0) 4(2.54,0) 5(5.08,0)
IND-SMD_L4.4-W4.2
  rect 1.4x2.12 smd: 1(2.028,0) 2(-2.028,0)
L0805
  rect 1.133x1.377 smd: 1(-0.966,0) 2(0.966,0)
LED0603-RD_RED
  rect 0.8x0.8 smd: 1(-0.799,-0.004) 2(0.799,0.004)
MIC-TH_BD6.0-P1.90-D0.4-L
  rect 1.3x1.3 hole 0.7: 1(-0.95,0)
  round 1.3 hole 0.7: 2(0.95,0)
R0603
  rect 0.806x0.864 smd: 1(-0.753,0) 2(0.753,0)
SMA_L4.3-W2.6-LS5.0-FD
  rect 2.046x1.62 smd: 1(-2.304,-0.009) 2(2.304,0.009)
SOP-8_L4.9-W3.9-P1.27-LS6.0-BL
  oval 0.63x1.865 smd: 1(-1.905,-2.683) 2(-0.635,-2.683) 3(0.635,-2.683) 4(1.905,-2.683) 5(1.905,2.683) 6(0.635,2.683) 7(-0.635,2.683) 8(-1.905,2.683)
SOT-23-6_L2.9-W1.6-P0.95-LS2.8-BR
  rect 1.1x0.6 smd: 1(1.35,-0.95) 2(1.35,0) 3(1.35,0.95) 4(-1.35,0.95) 5(-1.35,0) 6(-1.35,-0.95)
SOT-223-3_L6.5-W3.5-P3.05-LS7.0
  rect 2.5x1.1 smd: 1(2.97,-2.3) 2(2.97,0) 3(2.97,2.3)
  rect 2.34x3.6 smd: 4(-2.97,0)
SW-TH_4P-L7.5-W5.0-P4.50
  round 1.524 hole 1: 1(-2.25,1.25) 2(2.25,1.25)
  round 2.5 hole 1.5: 3(-3.5,-1.25) 4(3.5,-1.25)
SW-TH_XKB5858-Z-E
  round 1.6 hole 1: 1(-3.05,1.5) 2(-3.05,-0.5) 3(3.05,1.5) 4(3.05,-0.5) 5(-1,-1.5) 6(1,-1.5)
USB-C-SMD_TYPE-C-6PIN-2MD-073
  rect 0.55x1.1 smd: 1(-3.2,2.375) 2(-2.4,2.375) 11(2.4,2.375) 12(3.2,2.375)
  rect 0.3x1.1 smd: 3(-1.75,2.375) 4(-1.25,2.375) 5(-0.75,2.375) 6(-0.25,2.375) 7(0.25,2.375) 8(0.75,2.375) 9(1.25,2.375) 10(1.75,2.375)
  oval 1.1x2 hole 0.6x1.5: 13(-4.325,1.825) 14(4.325,1.825)
  oval 1.2x1.8 hole 0.6x1.2: 13(-4.325,-2.375) 14(4.325,-2.375)

## Nets
As in the schematic.

Pads without a net: AE1 2; SW1 3 4; SW2 3 4; SW3 3 4; SW4 3 4; SW5 3 4; SW6 3 4; SW9 1 3 5 6; SW10 5 6; U1 6; U2 18 22; U7 4; USB1 3 9

## Via types
v1: diameter 0.61, hole 0.305, Top Layer to Bottom Layer, 21 vias
v2: diameter 0.7, hole 0.3, Top Layer to Bottom Layer, 44 vias

## Routing (per net, layer and track width the routed paths; a pad name or vN(x,y) marks a point on that pad's centre or on a via; arc(x,y) is an arc through that point)
3V3: length 218.6
  Top Layer w0.254: 64.76,53.11 SW3.2 ; 64.76,53.11 50.92,53.11 ; 64.76,53.11 79.56,53.11 ; SW2.2 26.2,53.11 36.83,53.11 ; 36.83,53.11 38.24,51.69 ; 36.83,53.11 50.92,53.11 ; 50.92,53.11 SW6.2 ; v2(87.43,51.84) 86.16,53.11 79.56,53.11 ; v2(79.36,5.51) 79.36,5.52 C18.2 ; 79.56,53.11 SW4.2
  Top Layer w0.4: v2(20.63,19.56) 24.06,22.99 U2.10 ; U7.2 71.71,5.5 v2(69.04,5.5)
  Bottom Layer w0.254: v2(79.36,5.51) 96.04,5.51 96.94,6.41 96.94,16.79 93.28,20.45 93.28,45.99 v2(87.43,51.84)
  Bottom Layer w0.4: v2(69.04,5.5) 68.49,4.96 68.49,3.48 67.67,2.65 22.76,2.65 20.63,4.78 v2(20.63,19.56)
6V5: length 17.2
  Top Layer w0.254: U4.6 78.8,34.87 NC2.1 C15.1 84.54,34.68 C14.1 ; C9.1 84.54,41.36 C10.1 NC1.1 78.87,41.48 U3.6
AGND: length 63.5
  Top Layer w0.254: C14.2 84.54,36.08 C15.2 NC2.2 78.93,36.14 U4.7 ; 78.99,42.75 NC1.2 ; 78.99,42.75 80.89,42.75 C10.2 84.54,42.76 C9.2 ; 78.99,42.75 U3.7 ; MIC1.2 34.17,40.71 C2.1 34.8,39.7 35.45,39.05 40.54,39.05 42.66,41.17 R12.1 45.89,43.45 C8.2
  vias: v2(62.39,37.9) v2(62.8,45.01) v2(63.4,37.89) v2(63.85,45) v2(64.39,37.88) v2(64.97,44.99) v2(70.36,38.86) v2(71.42,38.83) v2(78.69,31.05) v2(79.62,31.06) v2(80.58,31.06)
GND:
  vias: v2(46.58,42.08) v2(47.75,42.07) v2(48.82,42.06) v2(70.97,23.72) v2(71.84,23.7) v2(73.47,23.45) v2(74.45,23.44) v2(75.44,23.44)
PGND: length 8.9
  Top Layer w0.6: R7.1 65.97,19.83 66.47,19.33 70.16,19.33 70.66,19.84 70.66,21.11 70.17,21.6 U1.2
VBAT+: length 109.9
  Top Layer w0.254: 2.08,12.69 2.08,13.62 2.69,14.23 26.55,14.23 H2.1 ; SW10.4 SW9.2
  Top Layer w0.6: H2.1 33,8.13 62.96,8.13 ; 62.96,8.13 44.11,26.97 C7.2 42.57,26.99 U2.25 ; 62.96,8.13 71.39,8.13 U7.3
  vias: v2(80.41,22.77) v2(80.41,22.02) v2(80.37,8.22) v2(80.37,7.41) v2(81.11,22.78) v2(81.12,22.01) v2(81.15,8.22) v2(81.15,7.41)
VBUS: length 113.5
  Top Layer w0.254: H2.2 27.16,16.51 7.8,16.51 6.02,18.29 2.52,18.29 2.08,17.84 2.08,17.01
  Top Layer w0.6: 82.7,14.36 59.2,14.36 45.06,28.5 C22.2 44.33,28.51 41.35,28.51 40.83,27.99 U2.26 ; v2(46.04,14.34) 46.01,14.34 41.98,10.31 33.35,10.31 H2.2
  Bottom Layer w0.6: v2(59.3,14.37) 59.28,14.34 v2(46.04,14.34)
VIN: length 10.4
  Top Layer w0.254: USB1.11 93.93,14.25 94.39,14.25 96.16,12.48 96.16,11.17 94.56,9.58 94.2,9.58 94.06,9.44 USB1.2
  Top Layer w0.5: D1.2 93.93,14.25
CLK: length 24.4
  Top Layer w0.254: U2.5 20.77,27.99 16.31,23.52 14.66,23.52 13.77,24.41 13.77,28.71 12.61,29.87 H1.4 ; 9.58,30.5 9.59,30.49
CS: length 27.8
  Top Layer w0.254: H1.2 8.57,24.79 7.93,24.14 7.93,21.11 9.96,19.07 17.96,19.07 23.87,24.99 U2.8
LED0: length 45.6
  Top Layer w0.254: U2.19 36.36,21.85 v1(36.36,19.33) ; 2.08,25.65 2.08,26.65 2.64,27.2 6.51,27.2 7.23,26.48 7.23,20.64 9.57,18.3 27.32,18.3 v1(27.33,18.29)
  Bottom Layer w0.254: v1(27.33,18.29) 35.32,18.29 v1(36.36,19.33)
LED1: length 43.2
  Top Layer w0.254: v1(26.38,17.56) 26.38,17.57 9.17,17.57 6.63,20.11 6.63,21.99 6.09,22.53 2.56,22.53 2.08,22.05 2.08,21.36 ; v1(37.38,18.41) 37.39,18.43 37.39,21.82 U2.20
  Bottom Layer w0.254: v1(26.38,17.56) 26.39,17.57 36.53,17.57 v1(37.38,18.41)
LOUT+: length 14.6
  Top Layer w0.254: U3.5 83.17,40.21 83.69,39.69 87.67,39.69 89.3,41.32 CN1.2
LOUT-: length 14.2
  Top Layer w0.254: U3.8 88.89,44.02 CN1.1
MFB: length 65.7
  Top Layer w0.254: U2.27 40.08,28.99 v2(40.23,29.13) ; v2(92.32,37.21) 96.18,37.21 SW10.2 SW10.1
  Bottom Layer w0.254: v2(40.23,29.13) 44.57,29.13 44.58,29.12 88.64,29.12 92.23,32.72 92.23,37.13 v2(92.32,37.21)
MIC_AN: length 8.9
  Top Layer w0.254: U2.31 37.36,34.24 v1(37.35,34.25) ; C3.2 39.69,39.82 v1(39.67,39.8)
  Bottom Layer w0.254: v1(37.35,34.25) 37.35,37.03 39.67,39.35 v1(39.67,39.8)
MIC_AP: length 11.1
  Top Layer w0.254: v1(38.99,41.9) 39.69,42.6 C1.2 ; U2.32 36.36,34.23 v1(36.33,34.25)
  Bottom Layer w0.254: v1(38.99,41.9) 38.3,41.2 38.3,39.64 36.35,37.69 36.35,34.26 v1(36.33,34.25)
MIC_BIAS: length 10.4
  Top Layer w0.254: v1(35.35,34.28) 35.35,33.13 U2.33 ; C3.1 38.08,41.24 R4.1 36.58,39.87 v1(36.57,39.87)
  Bottom Layer w0.254: v1(35.35,34.28) 35.35,38.64 v1(36.57,39.87)
MISO: length 20.9
  Top Layer w0.254: U2.7 23.47,25.99 17.32,19.84 14.02,19.84 11.66,22.2 10.26,22.2 10.21,22.25 H1.1
MOSI: length 25.3
  Top Layer w0.254: U2.6 23.08,26.99 16.69,20.6 14.53,20.6 12.88,22.25 12.88,26.6 12.15,27.33 H1.3
NEXT: length 32.4
  Top Layer w0.254: R20.1 43.49,49.31 v2(41.33,47.14) ; U2.16 v1(33.35,23.39)
  Bottom Layer w0.254: v1(33.35,23.39) 33.35,39.17 v2(41.33,47.14)
PIO6: length 20.9
  Top Layer w0.254: v1(32.31,20.09) 33.3,20.09 34.35,21.14 U2.17
  Bottom Layer w0.254: v1(32.31,20.09) 21.9,20.09 19.74,22.25 H3.5
PIO17: length 13.4
  Top Layer w0.254: U2.4 19.74,28.99 H3.4
PIO18: length 11.9
  Top Layer w0.254: U2.1 15.97,31.99 H3.1
PIO19: length 12.9
  Top Layer w0.254: U2.3 17.96,29.99 15.55,27.57 H3.3
PIO20: length 12.1
  Top Layer w0.254: H3.2 16.66,30.99 U2.2
PLAY: length 27.7
  Top Layer w0.254: U2.14 v1(31.35,23.39) ; R16.1 v2(21.26,43.71)
  Bottom Layer w0.254: v2(21.26,43.71) 21.26,33.49 v1(31.35,23.39)
PREV: length 26
  Top Layer w0.254: U2.15 32.35,23.31 v1(32.44,23.39) ; R19.1 34.1,46.39 v2(32.82,45.11)
  Bottom Layer w0.254: v1(32.44,23.39) 32.44,44.73 v2(32.82,45.11)
RESET: length 42
  Top Layer w0.254: v1(25.29,23.89) 27.12,23.89 U2.9
  Bottom Layer w0.254: SW1.1 0.84,31.84 0.84,37.61 1.73,38.5 13.47,38.5 25.29,26.68 v1(25.29,23.89)
RF_PORT: length 29
  Top Layer w0.155: AE1.1 7.75,45.84 7.75,43.03 14.01,36.77 26.5,36.77 29.36,33.91 U2.39
ROUT+: length 14.4
  Top Layer w0.254: U4.5 80.67,33.6 81.37,32.9 88.48,32.9 CN2.2
ROUT-: length 14.2
  Top Layer w0.254: CN2.1 88.45,37.41 U4.8
RX: length 8.5
  Top Layer w0.254: U2.12 29.35,18.86 31.8,16.41 31.8,14.38
SPK_LN: length 36.9
  Top Layer w0.254: U2.36 32.39,33.15 32.39,36.07 33.73,37.41 46.34,37.41 50.6,41.67 64.02,41.67
SPK_LP: length 37.7
  Top Layer w0.254: U2.37 31.36,36.79 32.82,38.25 45.39,38.25 v1(47.17,40.03) ; C12.1 v1(60.25,40.02)
  Bottom Layer w0.254: v1(47.17,40.03) 60.25,40.03 v1(60.25,40.02)
SPK_RN: length 31.5
  Top Layer w0.254: C16.1 60.97,34.87 v1(60.76,35.08) ; U2.34 34.36,34.58 34.85,35.08 v1(57.07,35.08) 57.09,35.08
  Bottom Layer w0.254: v1(60.76,35.08) v1(57.07,35.08)
SPK_RP: length 34.4
  Top Layer w0.254: C17.1 64,33.17 61.27,33.17 58.22,36.22 34.47,36.22 33.36,35.11 U2.35
TX: length 9.1
  Top Layer w0.254: U2.13 30.35,19.38 34.34,15.39 34.34,14.38
USB_N: length 65.2
  Top Layer w0.254: 92.92,11.26 93.09,11.09 USB1.5 ; 92.92,11.26 92.3,11.87 v2(92.24,11.87) ; 92.92,11.26 92.92,11.89 93.11,12.09 USB1.7 ; U2.23 40.84,24.99 v2(40.85,24.98)
  Bottom Layer w0.254: v2(40.85,24.98) 40.85,24.98 83.04,24.98 83.79,24.23 83.79,20.32 v2(92.24,11.87)
USB_P: length 66
  Top Layer w0.254: v2(92.61,12.81) 92.84,12.59 USB1.8 94.67,12.59 94.91,12.34 94.91,11.79 94.69,11.56 93.97,11.56 USB1.6 ; U2.24 39.9,25.99 v2(39.9,25.99)
  Bottom Layer w0.254: v2(92.61,12.81) 92.61,12.83 84.41,21.03 84.41,24.87 83.3,25.99 v2(39.9,25.99)
VOL+: length 35.1
  Top Layer w0.254: v1(43.63,31.92) 43.63,31.89 41.73,29.99 U2.28 ; v2(56.95,48.16) 56.95,49.18 58.09,50.33 R17.1
  Bottom Layer w0.254: v1(43.63,31.92) 45.46,33.74 45.46,43.66 47.7,45.9 55.32,45.9 56.94,47.52 56.94,48.15 v2(56.95,48.16)
VOL-: length 56.5
  Top Layer w0.254: v2(77.27,46.63) 78.79,46.63 79.29,47.13 R18.1 ; v1(40.98,31) 40.97,30.99 U2.29
  Bottom Layer w0.254: v1(40.98,31) 40.98,30.99 74.77,30.99 77.27,33.49 v2(77.27,46.63)
$1N572: length 5.8
  Top Layer w0.254: L1.2 34.74,42.81 C2.2 36.57,42.75 R4.2 38.23,42.75 C1.1
$1N573: length 5.8
  Top Layer w0.254: L1.1 30.46,42.61 MIC1.1
$1N825: length 3.3
  Top Layer w0.254: USB1.4 93.94,10.58 91.94,10.58 91.54,10.18 R3.1
$1N826: length 3.6
  Top Layer w0.254: USB1.10 92.2,13.59 90.9,12.28
$1N1214: length 5.2
  Top Layer w0.254: R16.2 21.26,50.71 SW2.1
$1N1216: length 3.6
  Top Layer w0.254: R17.2 61.29,52.09 SW3.1
$1N1223: length 4
  Top Layer w0.254: R18.2 77.78,50.38 SW4.1
$1N1225: length 4.2
  Top Layer w0.254: SW5.1 34.85,50.71 R19.2
$1N1227: length 3.9
  Top Layer w0.254: SW6.1 45.25,51.82 R20.2
$1N2036: length 2.4
  Top Layer w0.254: R8.2 68.89,41.48 69.32,41.48 69.32,41.48 U3.3
$1N2037: length 2.4
  Top Layer w0.254: R9.2 68.89,40.21 U3.4
$1N2038: length 1.8
  Top Layer w0.254: C11.2 67.15,41.71 R8.1
$1N2039: length 1.7
  Top Layer w0.254: R9.1 C12.2
$1N2041: length 2.7
  Top Layer w0.254: C8.1 69.3,43.45 70,42.75 U3.2
$1N2427: length 2.4
  Top Layer w0.254: U4.3 R10.2
$1N2428: length 2.5
  Top Layer w0.254: U4.4 68.95,33.6 R11.2
$1N2429: length 1.7
  Top Layer w0.254: R10.1 C16.2
$1N2430: length 1.8
  Top Layer w0.254: C17.2 67.07,33.23 R11.1
$1N2432: length 2.7
  Top Layer w0.254: 68.62,36.68 69.19,36.12 71.04,36.12 U4.2
$1N7630: length 1.8
  Top Layer w0.254: 2.09,15.37 3.8,15.37 3.85,15.42
$1N7631: length 1.8
  Top Layer w0.254: R2.2 3.8,11.09 LED3.1
$1N10372: length 9.2
  Top Layer w1: U8.1 91.23,23.25 93.51,20.96 96.08,20.96
$1N24423: length 1.7
  Top Layer w0.254: 2.16,24.05 3.82,24.05 3.86,24.09
$1N24424: length 1.8
  Top Layer w0.254: R15.2 3.81,19.76 2.09,19.76

## Copper pours and planes (outline as drawn; the poured copper is in the pictures)
3V3 on Top Layer: 70.46,6.23 76.9,6.23 76.9,4.81 70.46,4.81
6V5 on Top Layer: 61.57,22.94 66.38,22.94 66.38,21.92 61.57,21.92
6V5 on Top Layer: 73.11,41.8 77.33,41.8 77.33,41.17 73.11,41.17
6V5 on Top Layer: 61.58,44.35 74.49,44.35 74.49,25.58 61.58,25.58
6V5 on Top Layer: 70.13,37.73 74.5,37.73 74.5,37.09 70.13,37.09
6V5 on Top Layer: 61.58,27.21 63.63,27.21 63.63,21.91 61.58,21.91
6V5 on Top Layer: 70.12,44.34 74.49,44.34 74.49,43.7 70.12,43.7
6V5 on Top Layer: 73.09,35.17 77.31,35.17 77.31,34.54 73.09,34.54
AGND on Top Layer: 61.58,45.89 92.21,45.89 92.21,30.01 61.58,30.01
AGND on Bottom Layer: 61.58,45.89 92.21,45.89 92.21,30.01 61.58,30.01
GND on Top Layer: -2.89,56.67 102.52,56.67 102.52,-1.4 -2.89,-1.4
GND on Bottom Layer: -3.02,56.79 102.39,56.79 102.39,-1.27 -3.02,-1.27
PGND on Top Layer: 61.58,21.31 66.38,21.31 66.38,20.29 61.58,20.29
PGND on Top Layer: 61.58,21.31 62.44,21.31 62.44,18.41 61.58,18.41
VBAT+ on Top Layer: 81.98,28.07 97.14,28.07 97.14,23.1 81.98,23.1
VBAT+ on Top Layer: 80.03,24.74 84.03,24.74 84.03,21.63 80.03,21.63
VBAT+ on Top Layer: 75.53,8.58 81.5,8.58 81.5,6.96 75.53,6.96
VBAT+ on Top Layer: 70.46,8.35 76.89,8.35 76.89,6.96 70.46,6.96
VBAT+ on Bottom Layer: 80.03,23.23 81.5,23.23 81.5,6.94 80.03,6.94
VBUS on Top Layer: 81.98,21.54 84.01,21.54 84.01,12.85 81.98,12.85
$1N842 on Top Layer: 85.34,15.63 89.91,15.63 89.91,12.85 85.34,12.85
$1N2026 on Top Layer: 67.75,27.49 71.95,27.49 71.95,22.25 67.75,22.25
$1N2027 on Top Layer: 67.08,22.94 67.88,22.94 67.88,20.29 67.08,20.29
$1N2027 on Top Layer: 67.07,21.16 69.81,21.16 69.81,20.29 67.07,20.29
$1N20314 on Top Layer: 71.41,21.9 75.81,21.9 75.81,19.93 71.41,19.93
$1N20314 on Top Layer: 75.29,21.06 79.42,21.06 79.42,19.91 75.29,19.91
$1N20314 on Top Layer: 74.61,27.49 79.42,27.49 79.42,23.08 74.61,23.08
$1N20314 on Top Layer: 77.36,24.7 79.42,24.7 79.42,19.91 77.36,19.91

Small or netless copper shapes (teardrops, artwork), in the pictures only: 6 on Top Layer
